# EAGLE design Mainboard (EAGLE 5.10)
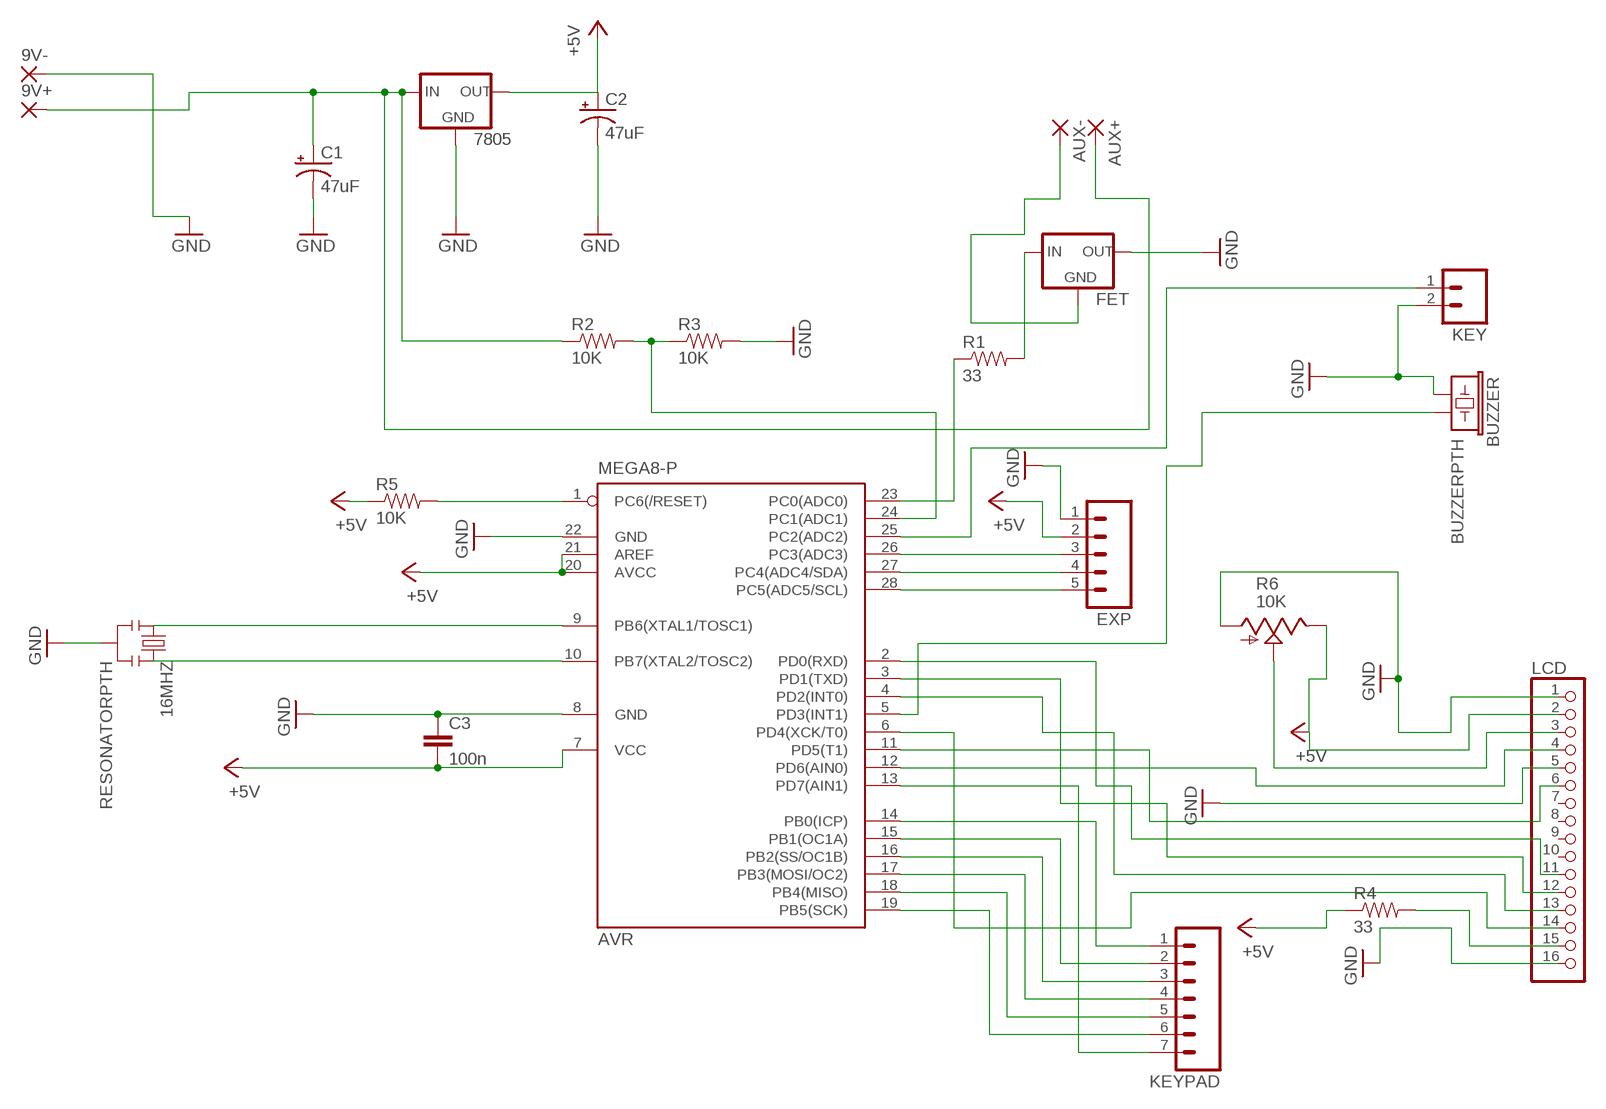
[diagram p0: schematic, sheet 1]

## Parts
9V+  2,54/1,1  [2,54/1,1]
9V-  2,54/1,1  [2,54/1,1]
16MHZ  RESONATORPTH  [RESONATOR-PTH]
7805  V_REG_78XXSIDE  [78XXL]
AUX+  2,54/1,1  [2,54/1,1]
AUX-  2,54/1,1  [2,54/1,1]
AVR  MEGA8-P  [DIL28-3]
BUZZER  BUZZERPTH  [BUZZER-12MM]
C1  47uF  CAP_POLPTH1  [CPOL-RADIAL-100UF-25V]
C2  47uF  CAP_POLPTH1  [CPOL-RADIAL-100UF-25V]
C3  100n  CAPPTH1  [CAP-PTH-5MM]
EXP  M05PTH  [1X05]
FET  V_REG_78XXSIDE  [78XXL]
KEY  M02LOCK  [1X02_LOCK]
KEYPAD  M07  [1X07]
LCD  PINHD-1X16  [1X16]
R1  33  RESISTORPTH1  [AXIAL-0.3]
R2  10K  RESISTORPTH1  [AXIAL-0.3]
R3  10K  RESISTORPTH1  [AXIAL-0.3]
R4  33  RESISTORPTH1  [AXIAL-0.3]
R5  10K  RESISTORPTH1  [AXIAL-0.3]
R6  10K  TRIM_US-CA6V  [CA6V]

## Nets
+5V: 7805.OUT AVR.7(VCC) AVR.20(AVCC) AVR.21(AREF) C2.1(+) C3.2 EXP.2 LCD.2 R4.P$1 R5.P$1 R6.E
GND: 9V-.1(P) 16MHZ.2 7805.GND AVR.8(GND) AVR.22(GND) BUZZER.+ C1.2(-) C2.2(-) C3.1 EXP.1 FET.OUT KEY.2 LCD.1 LCD.5 LCD.16 R3.P$2 R6.A
N$1: 9V+.1(P) 7805.IN AUX+.1(P) C1.1(+) R2.P$1
N$2: 16MHZ.1 AVR.9(PB6(XTAL1/TOSC1))
N$3: 16MHZ.3 AVR.10(PB7(XTAL2/TOSC2))
N$4: AVR.1(PC6(/RESET)) R5.P$2
N$5: FET.IN R1.P$2
N$6: AVR.23(PC0(ADC0)) R1.P$1
N$7: AUX-.1(P) FET.GND
N$8: AVR.5(PD3(INT1)) BUZZER.-
N$9: AVR.15(PB1(OC1A)) KEYPAD.2
N$10: AVR.24(PC1(ADC1)) R2.P$2 R3.P$1
N$11: AVR.13(PD7(AIN1)) KEYPAD.7
N$12: AVR.16(PB2(SS/OC1B)) KEYPAD.3
N$13: AVR.17(PB3(MOSI/OC2)) KEYPAD.4
N$14: AVR.18(PB4(MISO)) KEYPAD.5
N$15: AVR.19(PB5(SCK)) KEYPAD.6
N$16: AVR.14(PB0(ICP)) KEYPAD.1
N$17: AVR.3(PD1(TXD)) LCD.12
N$18: AVR.25(PC2(ADC2)) KEY.1
N$19: LCD.3 R6.S
N$20: AVR.12(PD6(AIN0)) LCD.4
N$21: LCD.15 R4.P$2
N$22: AVR.11(PD5(T1)) LCD.6
N$23: AVR.2(PD0(RXD)) LCD.11
N$24: AVR.4(PD2(INT0)) LCD.13
N$25: AVR.6(PD4(XCK/T0)) LCD.14
N$26: AVR.26(PC3(ADC3)) EXP.3
N$27: AVR.27(PC4(ADC4/SDA)) EXP.4
N$28: AVR.28(PC5(ADC5/SCL)) EXP.5
Unconnected: LCD.7 LCD.8 LCD.9 LCD.10

## Library data of the parts
9V+ 9V- AUX+ AUX- = wirepad:2,54/1,1: THROUGH-HOLE PAD
16MHZ = SparkFun:RESONATOR: Resonator Small SMD resonator. This is the itty bitty 10/20MHz resonators with built in caps. CSTCE10M0G55 and CSTCE20M0V53. Footprint has been reviewed closely but hasn't been tested yet.
7805 FET = SparkFun:V_REG_78XX: Voltage Regulator Standard 7805 5V regulator. IGO (Input Ground Output). Spark Fun Electronics SKU : COM-00107
AVR = atmel:MEGA8-P: MICROCONTROLLER 8 Kbytes FLASH, 1 kbytes SRAM, 512 bytes EEPROM, USART, 4-channel 10 bit ADC, 2-channel 8 bit ADC Pin compatible with Atmega48, ATMega88, ATMega168 Source: avr.lbr
BUZZER = SparkFun:BUZZER: Buzzer 12mm Spark Fun Electronics SKU : Comp-Buzzer
C1 C2 = SparkFun:CAP_POL: Capacitor Polarized These are standard SMD and PTH capacitors. Normally 10uF, 47uF, and 100uF in electrolytic and tantalum varieties. Always verify the external diameter of the through hole cap, it varies with capacity, voltage, and manufacturer. The EIA devices should be standard.
C3 = SparkFun:CAP: Capacitor Standard 0603 ceramic capacitor, and 0.1" leaded capacitor.
EXP = SparkFun:M05: Header 5 Standard 5-pin 0.1" header. Use with straight break away headers (SKU : PRT-00116), right angle break away headers (PRT-00553), swiss pins (PRT-00743), machine pins (PRT-00117), and female headers (PRT-00115). Molex polarized connector foot print use with SKU : PRT-08230 with associated crimp pins and housings.
KEY = SparkFun:M02: Header 2 Standard 2-pin 0.1" header. Use with straight break away headers (SKU : PRT-00116), right angle break away headers (PRT-00553), swiss pins (PRT-00743), machine pins (PRT-00117), and female headers (PRT-00115). Molex polarized connector foot print use with SKU : PRT-08233 with associated crimp pins and housings.
KEYPAD = SparkFun:M07: Header 7 Standard 7-pin 0.1" header. Use with straight break away headers (SKU : PRT-00116), right angle break away headers (PRT-00553), swiss pins (PRT-00743), machine pins (PRT-00117), and female headers (PRT-00115). NOTES ON THE VARIANTS LOCK and LOCK_LONGPADS... This footprint was designed to help hold the alignment of a through-hole component (i.e. 7-pin header) while soldering it into place. You may notice that each hole has been shifted either up or down by 0.005 of an inch from it's more standard position (which is usually a perfectly straight line). This slight alteration caused the pins (the squares in the middle) to touch the edges of the holes. Because they are alternating, it causes a "brace" to hold the header in place. 0.005 has proven to be the perfect amount of "off-center" position when using our standard breakaway headers. Although looks a little odd when you look at the bare footprint, once you have a header in there, the alteration is very hard to notice. Also, if you push a header all the way into place, it is covered up entirely on the bottom side. This idea of altering the position of holes to aid alignment will be further integrated into the Sparkfun Library for other footprints. It can help hold any component with 3 or more connection pins.
LCD = pinhead:PINHD-1X16: PIN HEADER
R1-R5 = SparkFun:RESISTOR: Resistor Basic schematic elements and footprints for 0603, 1206, and PTH 1/10th watt (small) resistors.
R6 = pot:TRIM_US-: POTENTIOMETER

## Board
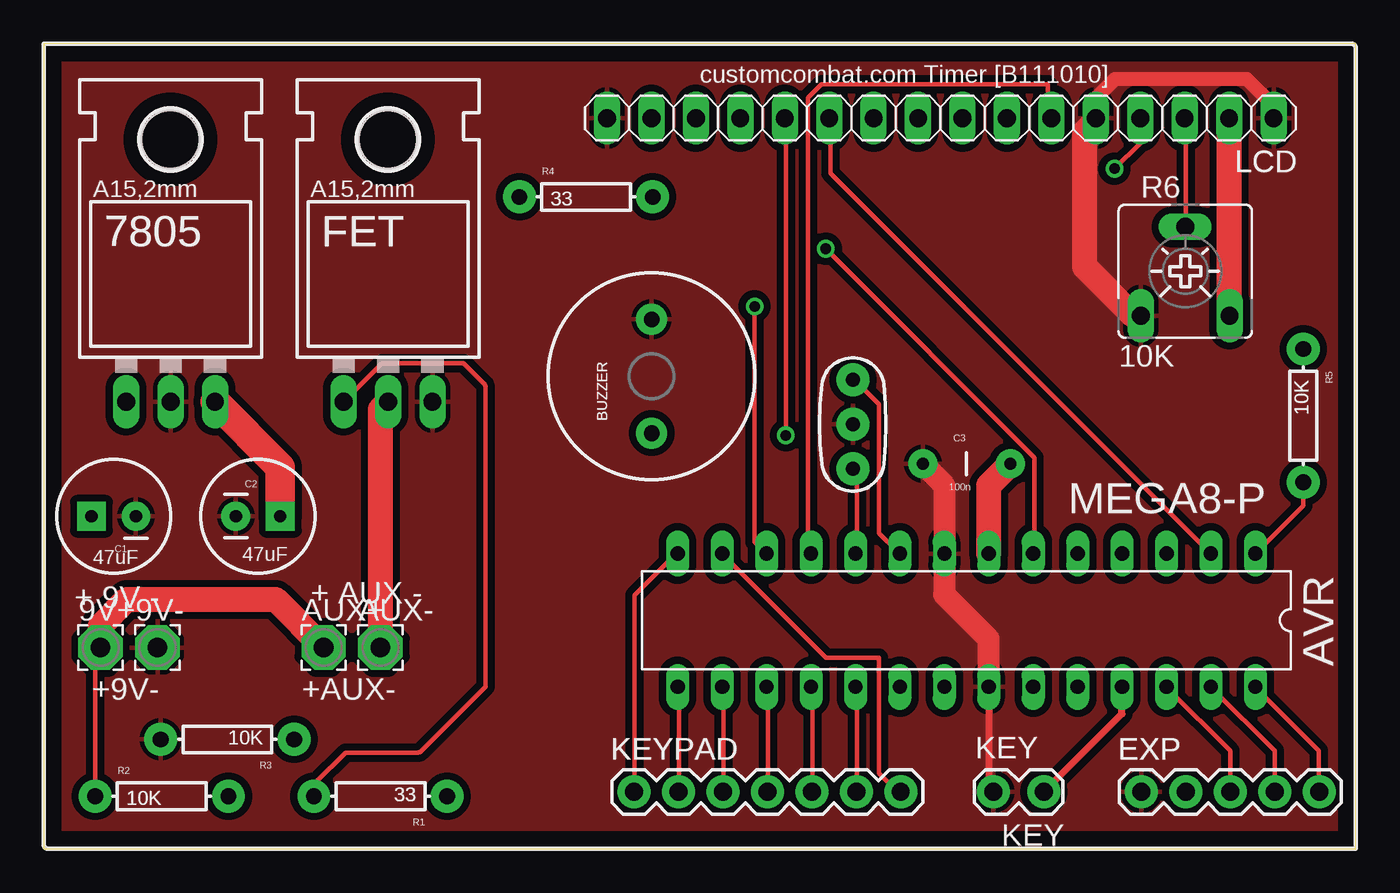
[diagram p1: board, top side]
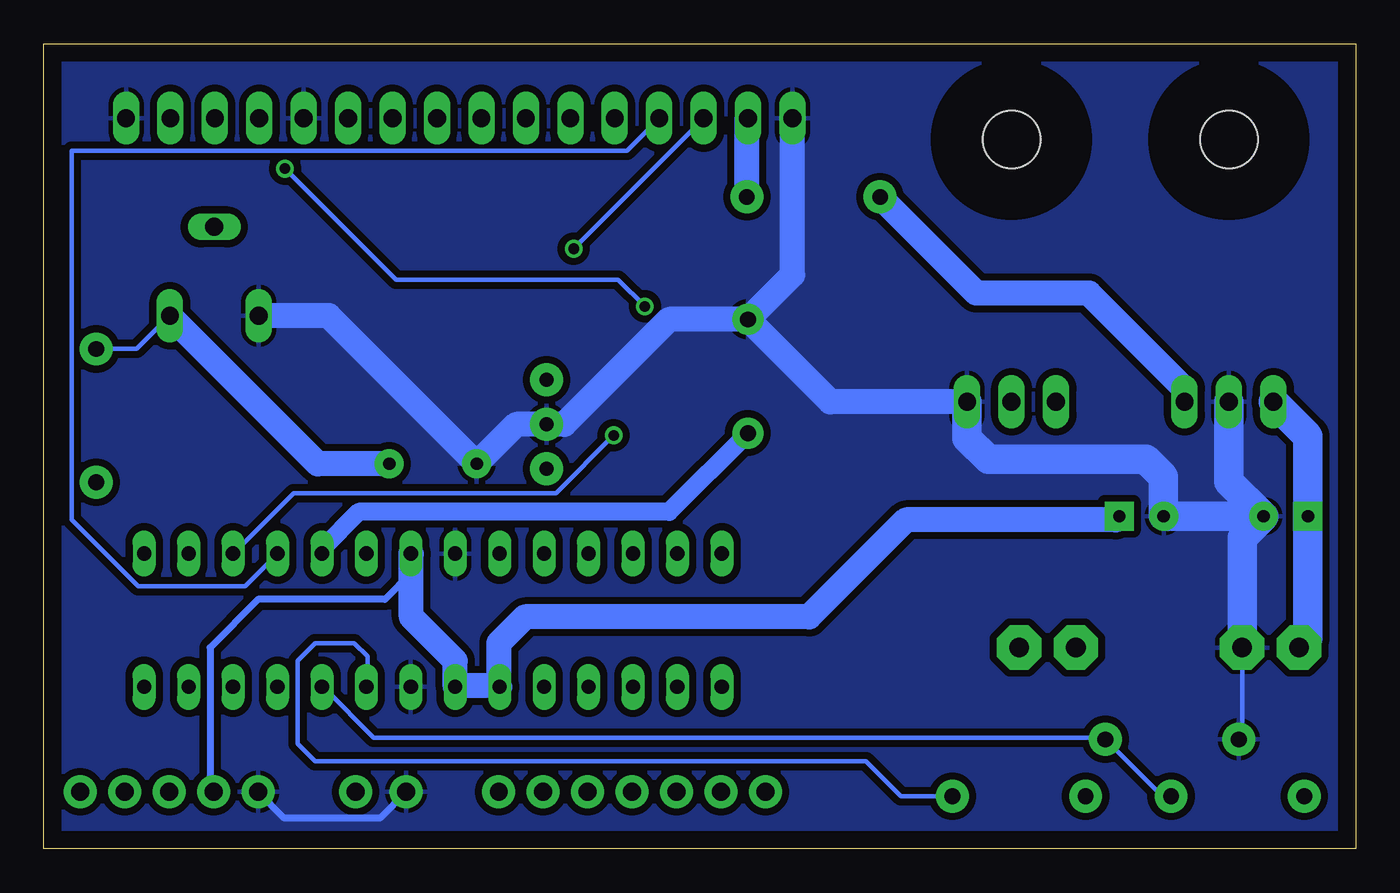
[diagram p2: board, bottom side, seen from below]

Size 75 x 46 mm. Coordinates in mm from the lower left corner, seen from the top.
Outline: 0,0 75,0 75,46 0,46 0,0
Copper layers (1*16): Top 0.035mm / dielectric 1.5mm / Bottom 0.035mm
Design rules "default": minimum track width 10mil, minimum drill 24mil, track to track 8mil, track to pad 8mil, pad to pad 8mil, via to via 8mil, smd to smd 8mil, copper to edge 40mil, drill to drill 8mil, minimum pad ring 10mil, minimum via ring 8mil, stop-mask expansion 4mil, vias tented up to drill 0mil, thermal gap 10mil

### Footprints (pad centres in the part's own frame; a part is rotated, then mirrored left to right if it is on the bottom)
2,54/1,1 = drill 1.118 pad 2.54 octagon: 1 0,0
RESONATOR-PTH = drill 0.8 pad 1.88 round: 1 -2.54,0; 2 0,0; 3 2.54,0
78XXL = drill 1.016 long: GND 0,-3.81; IN -2.54,-3.81; OUT 2.54,-3.81 | hole 3.302: 0,11.176
DIL28-3 = drill 0.813 long: 1 -16.51,-3.81; 2 -13.97,-3.81; 3 -11.43,-3.81; 4 -8.89,-3.81; 5 -6.35,-3.81; 6 -3.81,-3.81; 7 -1.27,-3.81; 8 1.27,-3.81; 9 3.81,-3.81; 10 6.35,-3.81; 11 8.89,-3.81; 12 11.43,-3.81; 13 13.97,-3.81; 14 16.51,-3.81; 15 16.51,3.81; 16 13.97,3.81; 17 11.43,3.81; 18 8.89,3.81; 19 6.35,3.81; 20 3.81,3.81; 21 1.27,3.81; 22 -1.27,3.81; 23 -3.81,3.81; 24 -6.35,3.81; 25 -8.89,3.81; 26 -11.43,3.81; 27 -13.97,3.81; 28 -16.51,3.81
BUZZER-12MM = drill 0.9 pad 1.778 round: + 3.25,0; - -3.25,0
CPOL-RADIAL-100UF-25V = drill 0.7 pad 1.651 square: 1 1.27,0 | drill 0.7 pad 1.651 round: 2 -1.27,0
CAP-PTH-5MM = drill 0.7 pad 1.651 round: 1 -2.5,0; 2 2.5,0
1X05 = drill 1.016 pad 1.88 round: 1 0,0; 2 2.54,0; 3 5.08,0; 4 7.62,0; 5 10.16,0
1X02_LOCK = drill 1.016 pad 1.88 round: 1 -0.178,0; 2 2.718,0
1X07 = drill 1.016 pad 1.88 round: 1 0,0; 2 2.54,0; 3 5.08,0; 4 7.62,0; 5 10.16,0; 6 12.7,0; 7 15.24,0
1X16 = drill 1.016 long: 1 -19.05,0; 2 -16.51,0; 3 -13.97,0; 4 -11.43,0; 5 -8.89,0; 6 -6.35,0; 7 -3.81,0; 8 -1.27,0; 9 1.27,0; 10 3.81,0; 11 6.35,0; 12 8.89,0; 13 11.43,0; 14 13.97,0; 15 16.51,0; 16 19.05,0
AXIAL-0.3 = drill 0.9 pad 1.88 round: P$1 -3.81,0; P$2 3.81,0
CA6V = drill 1.016 long: A -2.54,-2.54; E 2.54,-2.54; S 0,2.54

### Placement (x,y rotation side)
9V+  3.25,11.5 0 top
9V-  6.5,11.5 0 top
16MHZ  46.25,24.25 270 top
7805  7.25,29.35 0 top
AUX+  16,11.5 0 top
AUX-  19.25,11.5 0 top
AVR  52.75,13.06 180 top
BUZZER  34.75,27 90 top
C1  4,19 180 top
C2  12.25,19 0 top
C3  52.75,22 0 top
EXP  62.75,3.25 0 top
FET  19.68,29.35 0 top
KEY  57,3.25 180 top
KEYPAD  33.75,3.25 0 top
LCD  51.25,41.75 180 top
R1  19.25,3 180 top
R2  6.75,3 0 top
R3  10.5,6.25 180 top
R4  31,37.25 0 top
R5  72,24.75 270 top
R6  65.25,33 0 top

### Tracks (layer width: path | path; a pad name or v marks a point on that pad's centre or on a via)
+5V
  Top 0.254: C2.1 13.51,19.02 | LCD.2 67.82,41.66
  Top 0.61: R6.E arc45 67.82,30.53
  Top 1.422: AVR.7 54.02,20.77 C3.2 | R6.E 67.76,30.49 LCD.2
  Top 1.676: 7805.OUT 13.52,21.81 C2.1
  Bottom 0.254: C2.1 13.72,18.8 | R6.E 69.69,28.56 R5.P$1
  Bottom 0.406: EXP.2 65.5,3.46 65.5,11.5 62.75,14.25 55.5,14.25 54.02,15.73 AVR.7
  Bottom 1.422: 13.72,18.8 25.7,18.8 31.25,13.25 47.5,13.25 49,11.75 49,9.31 | 49,9.31 AVR.20 | 49,9.31 51.42,9.31 AVR.21 51.48,10.73 54,13.25 54,16.85 AVR.7 | C3.2 59.33,22 R6.E | R4.P$1 21.69,31.75 15.25,31.75 9.79,26.29 7805.OUT
GND
  Top 0.254: R6.A 62.48,30.48 | 60.2,41.66 LCD.5
  Top 0.406: AVR.22 54.02,3.51 KEY.2
  Top 0.813: 60.2,41.66 60.2,42.95 61.25,44 68.75,44 70.3,42.45 LCD.1
  Top 1.27: C3.1 51.48,20.77 AVR.8 51.48,14.52 54,12 54,9.27 AVR.22
  Top 1.422: 60.2,41.66 59.5,40.96 59.5,33.25 62.29,30.46 R6.A
  Bottom 0.254: 9V-.1 6.5,6.54 arc45 6.57,6.37 R3.P$2
  Bottom 0.406: EXP.1 61.25,1.75 55.78,1.75 KEY.2
  Bottom 0.61: BUZZER.+ 34.25,30.25
  Bottom 1.422: FET.OUT 30.04,25.54 BUZZER.+ | BUZZER.+ 39.25,30.25 45.25,24.25 16MHZ.2 48,24.25 C3.1 58.71,30.46 R6.A | LCD.16 32.2,32.8 BUZZER.+
  Bottom 1.676: C1.2 6.5,17.77 9V-.1 | C1.2 C2.2 11,19.02 11,21.25 12,22.25 21,22.25 22.22,23.47 FET.OUT | C1.2 7.25,20.98 7805.GND
  pour Bottom (isolate 0.406): 0,46 75,46 75,0 0,0
  pour Top (isolate 0.406): 0,46 75,46 75,0 0,0
N$1
  Top 0.254: 9V+.1 2.94,11.19 R2.P$1
  Top 1.422: 9V+.1 3.25,12.75 4.75,14.25 13.25,14.25 AUX+.1
  Bottom 1.676: 7805.IN 2.73,23.56 C1.1 2.73,12.02 9V+.1
N$2
  Top 0.254: AVR.9 48.77,17.02 47.75,18.03 47.75,25.4 46.48,26.67 16MHZ.1
N$3
  Top 0.254: AVR.10 46.48,17.02 46.48,21.59 16MHZ.3
N$4
  Top 0.254: AVR.1 72,19.61 R5.P$2
N$5
  Top 0.254: FET.IN 19.28,27.68 arc-45 19.45,27.75 24,27.75 25.18,26.57 arc-45 25.25,26.39 25.25,9.25 21.57,5.57 arc-45 21.39,5.5 17.25,5.5 15.51,3.76 arc45 15.44,3.58 R1.P$2
N$6
  Bottom 0.254: R1.P$1 26,3 28,5 59.5,5 60.5,6 60.5,10.75 59.5,11.75 57.25,11.75 56.5,11 56.5,9.31 AVR.23
N$7
  Top 1.422: FET.GND 19.25,25.11 AUX-.1
N$8
  Bottom 1.016: BUZZER.- 39.25,19.25 57,19.25 59.1,17.15 AVR.5
N$9
  Top 0.254: AVR.15 36.32,9.14 36.32,3.3 KEYPAD.2
N$10
  Bottom 0.254: AVR.24 58.93,9.14 56.13,6.35 14.48,6.35 R3.P$1 11.13,3.07 arc-45 10.96,3 R2.P$2
N$11
  Top 0.254: AVR.13 38.86,16.76 44.7,10.92 47.75,10.92 47.75,4.32 48.77,3.3 KEYPAD.7
N$12
  Top 0.254: AVR.16 38.86,9.14 38.86,3.3 KEYPAD.3
N$13
  Top 0.254: AVR.17 41.4,9.14 41.4,3.3 KEYPAD.4
N$14
  Top 0.254: AVR.18 43.94,9.14 43.94,3.3 KEYPAD.5
N$15
  Top 0.254: AVR.19 46.48,9.14 46.48,3.3 KEYPAD.6
N$16
  Top 0.254: AVR.14 36.07,16.76 33.78,14.48 33.78,3.3 KEYPAD.1
N$17  (via drill 0.61)
  Top 0.254: v42.42,23.62 42.42,41.66 LCD.12
  Bottom 0.254: v42.42,23.62 45.72,20.32 60.71,20.32 64.01,17.02 AVR.3
N$18
  Top 0.406: KEY.1 61.64,7.71 AVR.25
N$19
  Top 0.254: LCD.3 65.28,41.66 65.28,35.56 R6.S
N$20  (via drill 0.61)
  Top 0.254: AVR.12 40.64,17.55 v40.64,30.99 | v61.21,38.86 62.68,40.33 LCD.4
  Bottom 0.254: v40.64,30.99 42.16,32.51 54.86,32.51 v61.21,38.86
N$21
  Bottom 1.422: R4.P$2 34.81,41.68 LCD.15
N$22
  Top 0.254: AVR.11 43.69,17.02 43.69,42.93 44.45,43.69 57.4,43.69 57.4,41.91 LCD.6
N$23
  Top 0.254: AVR.2 66.55,17.02 44.96,38.61 44.96,41.66 LCD.11
N$24
  Bottom 0.254: AVR.4 61.72,16.76 63.5,14.99 69.6,14.99 73.41,18.8 73.41,39.88 41.66,39.88 39.88,41.66 LCD.13
N$25  (via drill 0.61)
  Top 0.254: v44.7,34.29 56.64,22.35 56.64,17.02 AVR.6
  Bottom 0.254: v44.7,34.29 37.34,41.66 LCD.14
N$26
  Top 0.254: AVR.26 64.26,9.14 67.82,5.59 67.82,3.3 EXP.3
N$27
  Top 0.254: AVR.27 66.8,9.14 70.36,5.59 70.36,3.3 EXP.4
N$28
  Top 0.254: AVR.28 69.34,9.14 72.9,5.59 72.9,3.3 EXP.5

### Text on the board
tPlace: + 9V - | + AUX -
_tsilk: customcombat.com Timer [B111010] | LCD | 33 | 7805 | FET | 10K | 10K | BUZZER | MEGA8-P | 100n | 47uF | 47uF | +9V- | +AUX- | 10K | KEY | KEYPAD | EXP | 33 | 10K